# EAGLE schematic pck100clone (EAGLE 6.6.0)
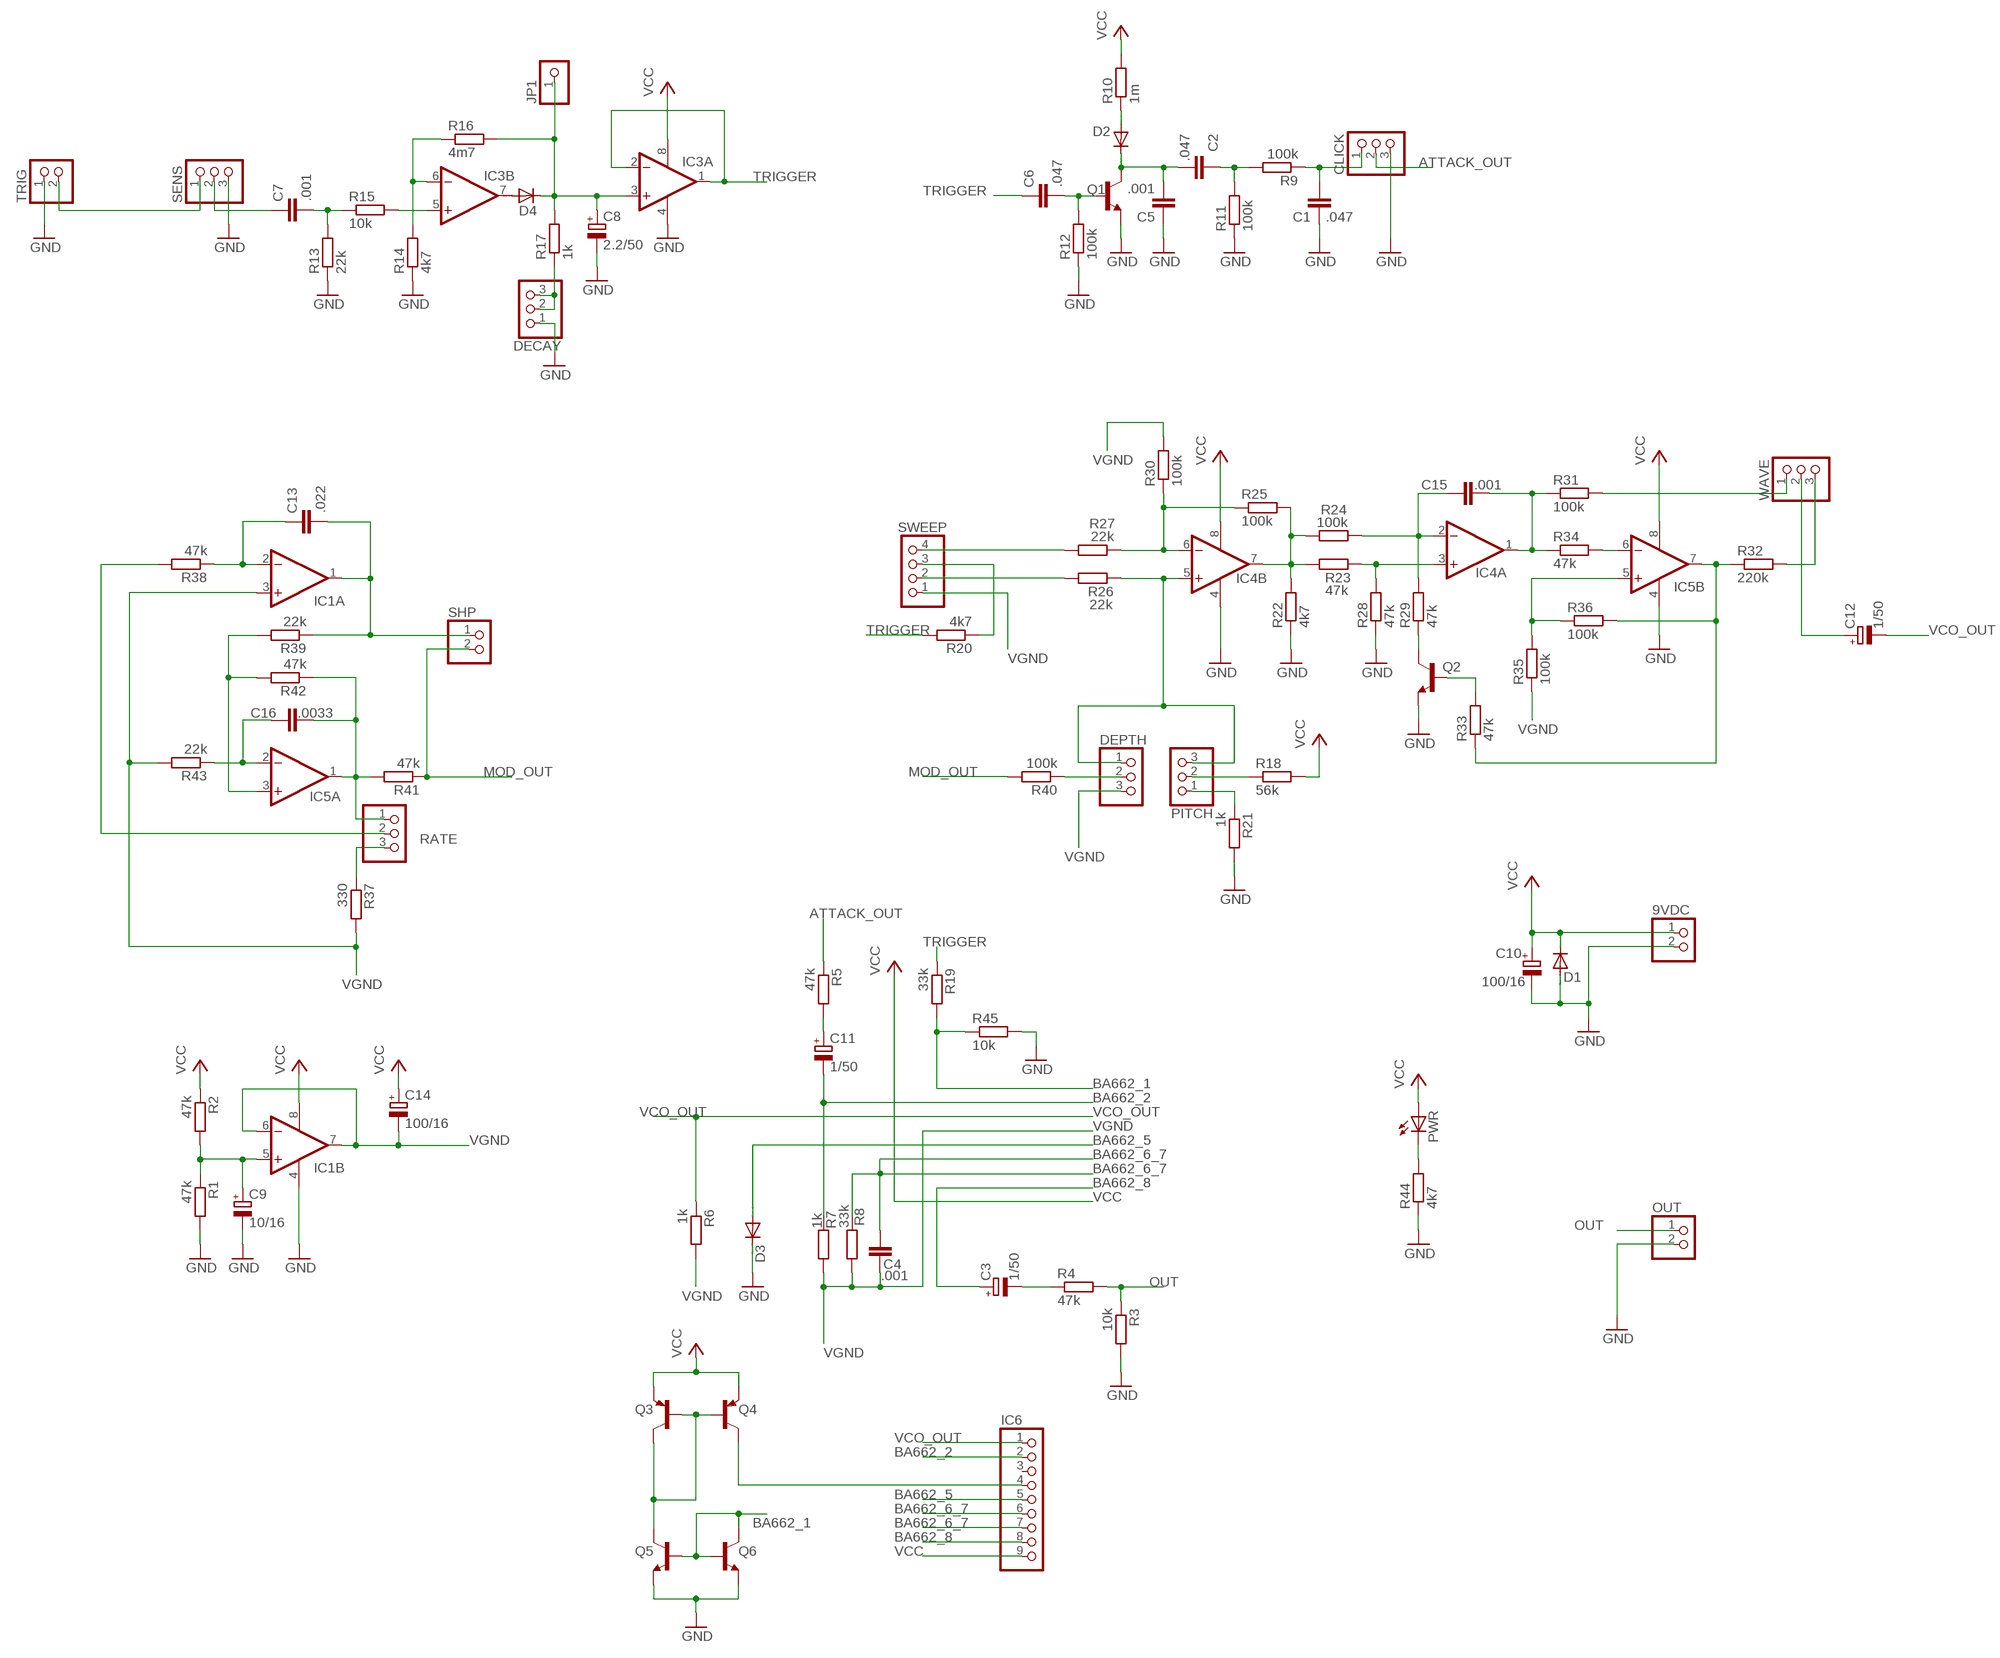
[diagram p0: schematic, sheet 1]

## Parts
9VDC  PINHD-1X2  [1X02]
C1  .047  C-EU050-025X075  [C050-025X075]
C2  .047  C-EU050-025X075  [C050-025X075]
C3  1/50  CPOL-EUE2.5-5  [E2,5-5]
C4  .001  C-EU050-025X075  [C050-025X075]
C5  .001  C-EU050-025X075  [C050-025X075]
C6  .047  C-EU050-025X075  [C050-025X075]
C7  .001  C-EU050-025X075  [C050-025X075]
C8  2.2/50  CPOL-EUE2.5-5  [E2,5-5]
C9  10/16  CPOL-EUE2.5-5  [E2,5-5]
C10  100/16  CPOL-EUE2.5-5  [E2,5-5]
C11  1/50  CPOL-EUE2.5-5  [E2,5-5]
C12  1/50  CPOL-EUE2.5-5  [E2,5-5]
C13  .022  C-EU050-025X075  [C050-025X075]
C14  100/16  CPOL-EUE2.5-5  [E2,5-5]
C15  .001  C-EU050-025X075  [C050-025X075]
C16  .0033  C-EU050-025X075  [C050-025X075]
CLICK  PINHD-1X3  [1X03]
D1  1N4004  [DO41-10]
D2  1N4148DO35-7  [DO35-7]
D3  1N4148DO35-7  [DO35-7]
D4  1N4148DO35-7  [DO35-7]
DECAY  PINHD-1X3  [1X03]
DEPTH  PINHD-1X3  [1X03]
IC1  LM358N  [DIL08]
IC3  LM358N  [DIL08]
IC4  LM358N  [DIL08]
IC5  LM358N  [DIL08]
IC6  PINHD-1X9  [1X09]
JP1  PINHD-1X1  [1X01]
OUT  PINHD-1X2  [1X02]
PITCH  PINHD-1X3  [1X03]
PWR  LED3MM  [LED3MM]
Q1  2SC945  [TO92-ECB]
Q2  2SC945  [TO92-ECB]
Q3  2N3906  [TO92]
Q4  2N3906  [TO92]
Q5  2N3904  [TO92]
Q6  2N3904  [TO92]
R1  47k  R-EU_0207/7  [0207/7]
R2  47k  R-EU_0207/7  [0207/7]
R3  10k  R-EU_0207/7  [0207/7]
R4  47k  R-EU_0207/7  [0207/7]
R5  47k  R-EU_0207/7  [0207/7]
R6  1k  R-EU_0207/7  [0207/7]
R7  1k  R-EU_0207/7  [0207/7]
R8  33k  R-EU_0207/7  [0207/7]
R9  100k  R-EU_0207/7  [0207/7]
R10  1m  R-EU_0207/7  [0207/7]
R11  100k  R-EU_0207/7  [0207/7]
R12  100k  R-EU_0207/7  [0207/7]
R13  22k  R-EU_0207/7  [0207/7]
R14  4k7  R-EU_0207/7  [0207/7]
R15  10k  R-EU_0207/7  [0207/7]
R16  4m7  R-EU_0207/7  [0207/7]
R17  1k  R-EU_0207/7  [0207/7]
R18  56k  R-EU_0207/7  [0207/7]
R19  33k  R-EU_0207/7  [0207/7]
R20  4k7  R-EU_0207/7  [0207/7]
R21  1k  R-EU_0207/7  [0207/7]
R22  4k7  R-EU_0207/7  [0207/7]
R23  47k  R-EU_0207/7  [0207/7]
R24  100k  R-EU_0207/7  [0207/7]
R25  100k  R-EU_0207/7  [0207/7]
R26  22k  R-EU_0207/7  [0207/7]
R27  22k  R-EU_0207/7  [0207/7]
R28  47k  R-EU_0207/7  [0207/7]
R29  47k  R-EU_0207/7  [0207/7]
R30  100k  R-EU_0207/7  [0207/7]
R31  100k  R-EU_0207/7  [0207/7]
R32  220k  R-EU_0207/7  [0207/7]
R33  47k  R-EU_0207/7  [0207/7]
R34  47k  R-EU_0207/7  [0207/7]
R35  100k  R-EU_0207/7  [0207/7]
R36  100k  R-EU_0207/7  [0207/7]
R37  330  R-EU_0207/7  [0207/7]
R38  47k  R-EU_0207/7  [0207/7]
R39  22k  R-EU_0207/7  [0207/7]
R40  100k  R-EU_0207/7  [0207/7]
R41  47k  R-EU_0207/7  [0207/7]
R42  47k  R-EU_0207/7  [0207/7]
R43  22k  R-EU_0207/7  [0207/7]
R44  4k7  R-EU_0207/7  [0207/7]
R45  10k  R-EU_0207/7  [0207/7]
RATE  PINHD-1X3  [1X03]
SENS  PINHD-1X3  [1X03]
SHP  PINHD-1X2  [1X02]
SWEEP  PINHD-1X4  [1X04]
TRIG  PINHD-1X2  [1X02]
WAVE  PINHD-1X3  [1X03]

## Nets
ATTACK_OUT: CLICK.2 R5.1
BA662_1: Q5.2(B) Q6.1(C) Q6.2(B) R19.2 R45.1
BA662_2: C11.- IC6.2 R7.1
BA662_5: D3.A IC6.5
BA662_6_7: C4.2 IC6.6 IC6.7 R8.1
BA662_8: C3.+ IC6.8
GND: 9VDC.2 C1.1 C5.1 C8.- C9.- C10.- CLICK.3 D1.A D3.C DECAY.1 IC1.4(P:V-) IC3.4(P:V-) IC4.4(P:V-) IC5.4(P:V-) OUT.2 Q1.E Q2.E Q5.3(E) Q6.3(E) R1.2 R3.2 R11.1 R12.1 R13.1 R14.1 R21.2 R22.1 R28.1 R44.1 R45.2 SENS.3 TRIG.1
MOD_OUT: R40.2 R41.1 SHP.2
N$1: SENS.1 TRIG.2
N$3: C7.1 SENS.2
N$4: C7.2 R13.2 R15.1
N$5: IC3.5(B:+IN) R15.2
N$6: IC3.6(B:-IN) R14.2 R16.1
N$7: D4.A IC3.7(B:OUT)
N$8: C8.+ D4.C IC3.3(A:+IN) JP1.1 R16.2 R17.2
N$9: DECAY.2 DECAY.3 R17.1
N$10: C6.2 Q1.B R12.2
N$11: C2.2 C5.2 D2.C Q1.C
N$12: D2.A R10.1
N$13: C2.1 R9.2 R11.2
N$14: C1.2 CLICK.1 R9.1
N$15: C13.2 IC1.1(A:OUT) R39.1 SHP.1
N$16: C13.1 IC1.2(A:-IN) R38.1
N$17: R38.2 RATE.2
N$19: C16.1 IC5.2(A:-IN) R43.1
N$20: C16.2 IC5.1(A:OUT) R41.2 R42.1 RATE.1
N$21: R20.1 SWEEP.3
N$22: R37.1 RATE.3
N$23: IC5.3(A:+IN) R39.2 R42.2
N$24: R27.2 SWEEP.4
N$25: R26.2 SWEEP.2
N$26: IC4.6(B:-IN) R25.1 R27.1 R30.1
N$27: DEPTH.1 IC4.5(B:+IN) PITCH.3 R26.1
N$28: DEPTH.2 R40.1
N$29: PITCH.2 R18.1
N$30: PITCH.1 R21.1
N$31: C9.+ IC1.5(B:+IN) R1.1 R2.2
N$32: IC4.7(B:OUT) R22.2 R23.1 R24.1 R25.2
N$33: IC4.3(A:+IN) R23.2 R28.2
N$34: C15.2 IC4.2(A:-IN) R24.2 R29.2
N$35: Q2.C R29.1
N$36: Q2.B R33.2
N$37: C15.1 IC4.1(A:OUT) R31.1 R34.1
N$38: IC5.6(B:-IN) R34.2
N$39: R31.2 WAVE.1
N$40: IC5.7(B:OUT) R32.1 R33.1 R36.2
N$41: R32.2 WAVE.3
N$42: IC5.5(B:+IN) R35.2 R36.1
N$43: C12.+ WAVE.2
N$44: PWR.K(C) R44.2
N$45: IC6.4 Q4.1(C)
N$47: C11.+ R5.2
N$48: Q3.1(C) Q3.2(B) Q4.2(B) Q5.1(C)
N$51: C3.- R4.1
OUT: OUT.1 R3.1 R4.2
TRIGGER: C6.1 IC3.1(A:OUT) IC3.2(A:-IN) R19.1 R20.2
VCC: 9VDC.1 C10.+ C14.+ D1.C IC1.8(P:V+) IC3.8(P:V+) IC4.8(P:V+) IC5.8(P:V+) IC6.9 PWR.A Q3.3(E) Q4.3(E) R2.1 R10.2 R18.2
VCO_OUT: C12.- IC6.1 R6.1
VGND: C4.1 C14.- DEPTH.3 IC1.3(A:+IN) IC1.6(B:-IN) IC1.7(B:OUT) R6.2 R7.2 R8.2 R30.2 R35.1 R37.2 R43.2 SWEEP.1
Unconnected: IC6.3

## Library data of the parts
9VDC OUT SHP TRIG = pinhead:PINHD-1X2: PIN HEADER
C1 C2 C4-C7 C13 C15 C16 = rcl:C-EU: CAPACITOR, European symbol
C3 C8-C12 C14 = rcl:CPOL-EU: POLARIZED CAPACITOR, European symbol
CLICK DECAY DEPTH PITCH RATE SENS WAVE = pinhead:PINHD-1X3: PIN HEADER
D1 = diode:1N4004: DIODE general purpose rectifier, 1 A
D2-D4 = diode:1N4148: DIODE high speed (Philips)
IC1 IC3-IC5 = linear:LM358: OP AMP also LM158; LM258; LM2904 Source: http://cache.national.com/ds/LM/LM158.pdf
IC6 = pinhead:PINHD-1X9: PIN HEADER
JP1 = pinhead:PINHD-1X1: PIN HEADER
PWR = led:LED: LED OSRAM: - CHIPLED LG R971, LG N971, LY N971, LG Q971, LY Q971, LO R971, LY R971 LH N974, LH R974 LS Q976, LO Q976, LY Q976 LO Q996 - Hyper CHIPLED LW Q18S LB Q993, LB Q99A, LB R99A - SideLED LS A670, LO A670, LY A670, LG A670, LP A670 LB A673, LV A673, LT A673, LW A673 LH A674 LY A675 LS A676, LA A676, LO A676, LY A676, LW A676 LS A679, LY A679, LG A679 - Hyper Micro SIDELED® LS Y876, LA Y876, LO Y876, LY Y876 LT Y87S - SmartLED LW L88C, LW L88S LB L89C, LB L89S, LG L890 LS L89K, LO L89K, LY L89K LS L896, LA L896, LO L896, LY L896 - TOPLED LS T670, LO T670, LY T670, LG T670, LP T670 LSG T670, LSP T670, LSY T670, LOP T670, LYG T670 LG T671, LOG T671, LSG T671 LB T673, LV T673, LT T673, LW T673 LH T674 LS T676, LA T676, LO T676, LY T676, LB T676, LH T676, LSB T676, LW T676 LB T67C, LV T67C, LT T67C, LS T67K, LO T67K, LY T67K, LW E67C LS E67B, LA E67B, LO E67B, LY E67B, LB E67C, LV E67C, LT E67C LW T67C LS T679, LY T679, LG T679 LS T770, LO T770, LY T770, LG T770, LP T770 LB T773, LV T773, LT T773, LW T773 LH T774 LS E675, LA E675, LY E675, LS T675 LS T776, LA T776, LO T776, LY T776, LB T776 LHGB T686 LT T68C, LB T68C - Hyper Mini TOPLED® LB M676 - Mini TOPLED Santana® LG M470 LS M47K, LO M47K, LY M47K Source: http://www.osram.convergy.de LUXEON: - LUMILED® LXK2-PW12-R00, LXK2-PW12-S00, LXK2-PW14-U00, LXK2-PW14-V00 LXK2-PM12-R00, LXK2-PM12-S00, LXK2-PM14-U00 LXK2-PE12-Q00, LXK2-PE12-R00, LXK2-PE12-S00, LXK2-PE14-T00, LXK2-PE14-U00 LXK2-PB12-K00, LXK2-PB12-L00, LXK2-PB12-M00, LXK2-PB14-N00, LXK2-PB14-P00, LXK2-PB14-Q00 LXK2-PR12-L00, LXK2-PR12-M00, LXK2-PR14-Q00, LXK2-PR14-R00 LXK2-PD12-Q00, LXK2-PD12-R00, LXK2-PD12-S00 LXK2-PH12-R00, LXK2-PH12-S00 LXK2-PL12-P00, LXK2-PL12-Q00, LXK2-PL12-R00 Source: www.luxeon.com KINGBRIGHT: KA-3528ASYC Source: www.kingbright.com
Q1 Q2 = transistor:2SC945: NPN Silicon Epitaxial Planar Transistor Source: SEMTECH ELECTRONICS LTD. ... 2SC945 2.pdf
Q3 Q4 = transistor-pnp:2N3906: PNP Transistor
Q5 Q6 = transistor:2N3904: NPN TRANSISTOR
R1-R45 = rcl:R-EU_: RESISTOR, European symbol
SWEEP = pinhead:PINHD-1X4: PIN HEADER